# Altium schematic sheet Main Schematic.SchDoc
size A4
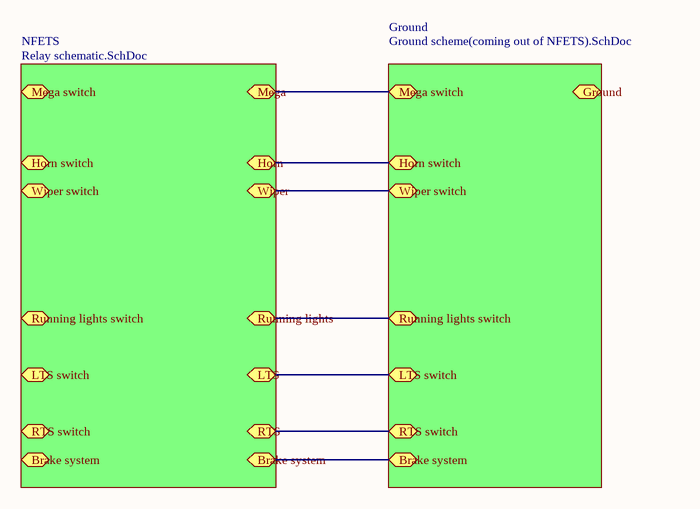
[diagram p0: Main Schematic.SchDoc]

## Sub-sheets
Ground = Ground scheme(coming out of NFETS).SchDoc: no entries
NFETS = Relay schematic.SchDoc: no entries

## Ports
Brake system, Ground, Horn, Horn switch, LTS, LTS switch, Mega, Mega switch, RTS, RTS switch, Running lights, Running lights switch, Wiper, Wiper switch

## Nets
Horn: port Horn switch, port Horn
LTS: port LTS switch, port LTS
Mega: port Mega switch, port Mega
RTS: port RTS switch, port RTS
Running lights: port Running lights switch, port Running lights
Wiper: port Wiper switch, port Wiper